# EAGLE design powerboard (EAGLE 9.4.2)
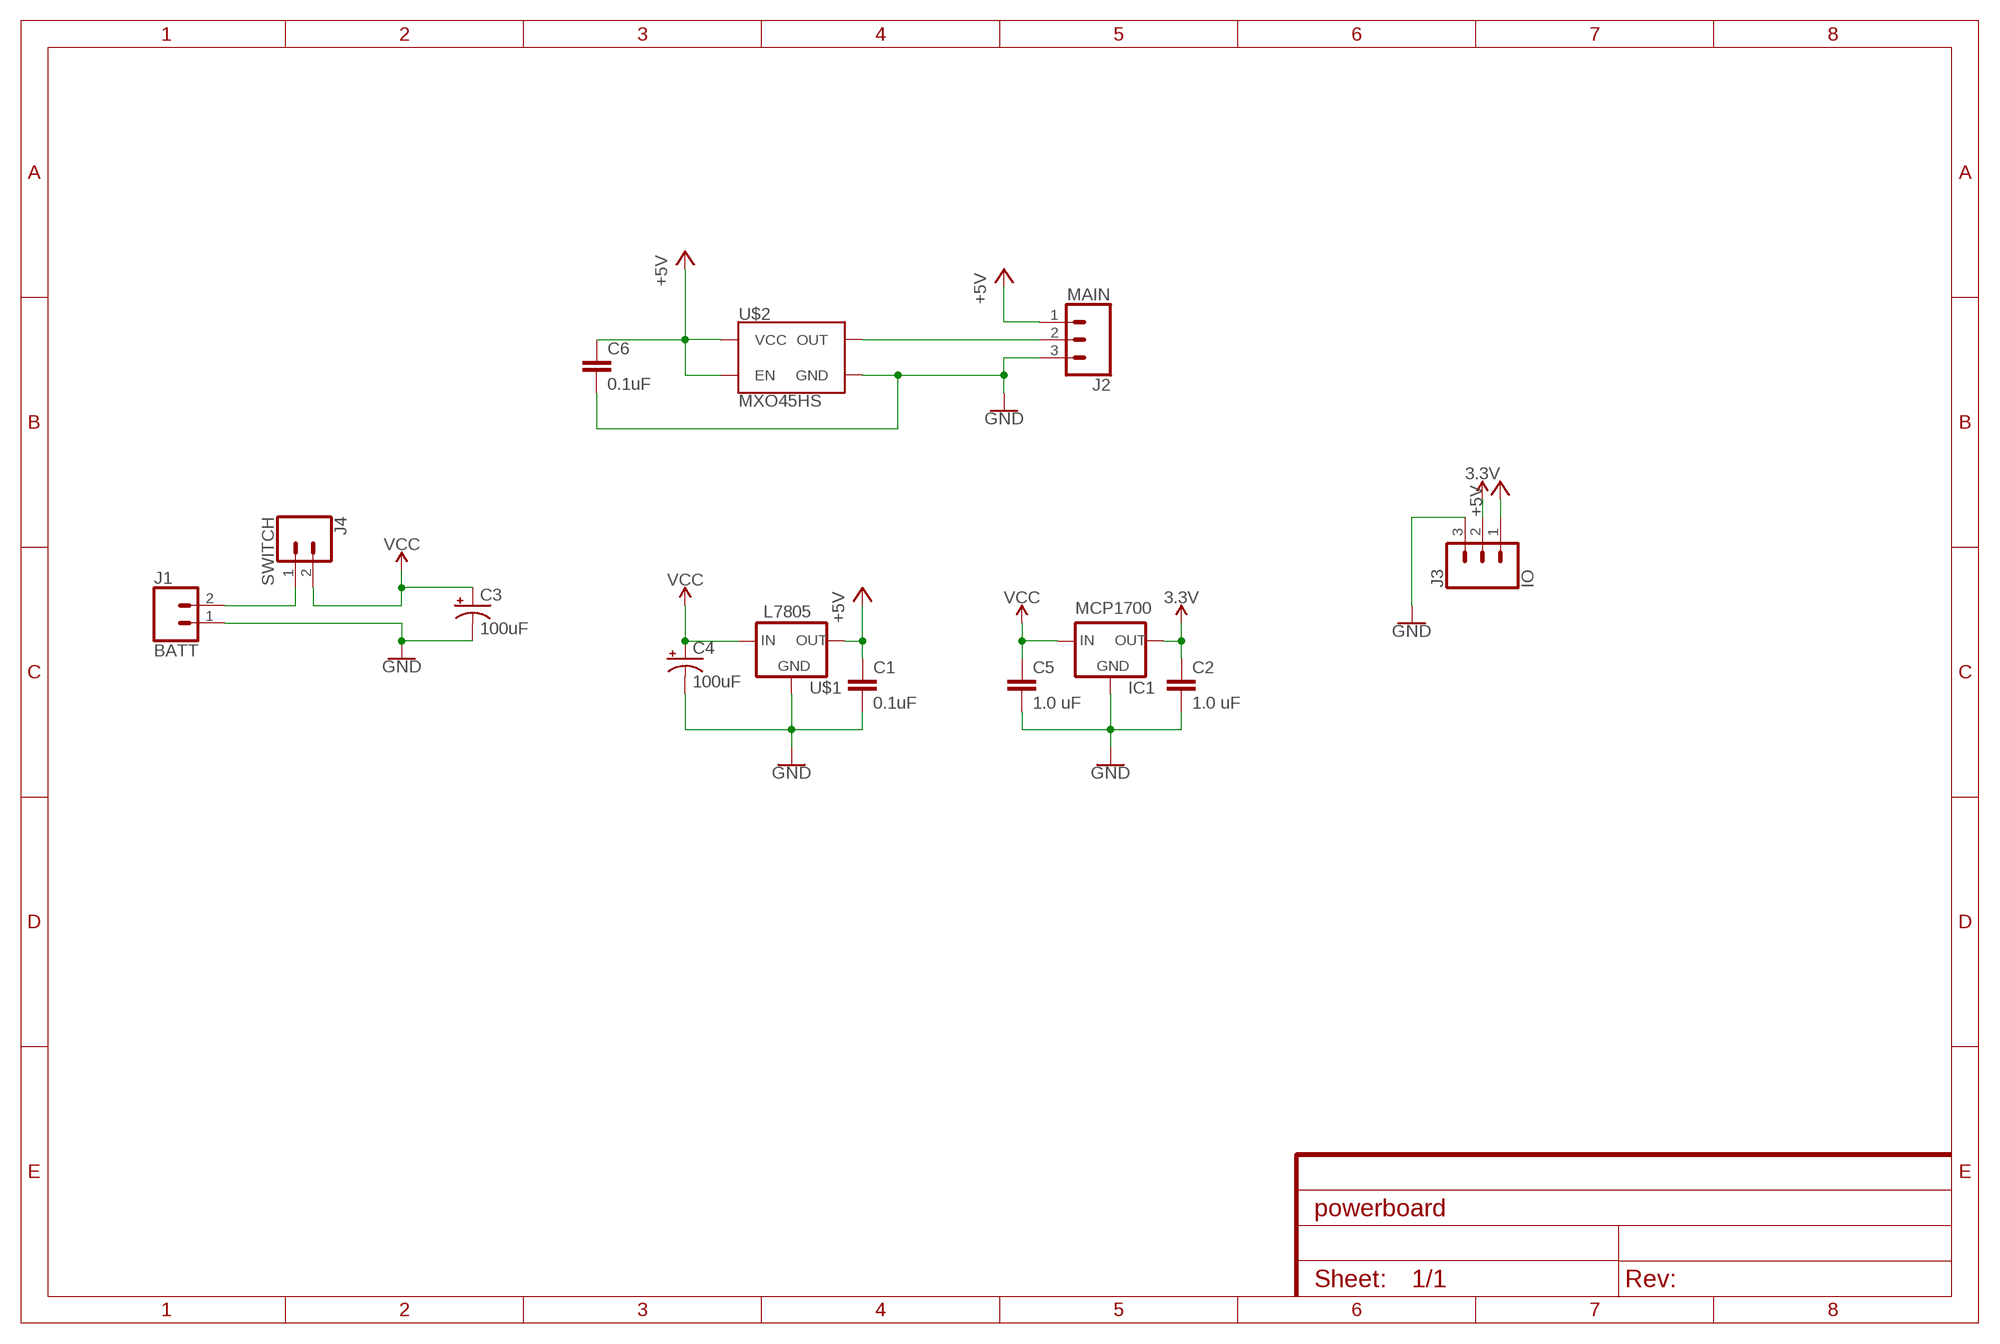
[diagram p0: schematic, sheet 1]

## Parts
C1  0.1uF  C2,5-3  [C2.5-3]
C2  1.0 uF  C2,5-3  [C2.5-3]
C3  100uF  100UF-POLAR-RADIAL-2.5MM-25V-20%  [CPOL-RADIAL-2.5MM-6.5MM]
C4  100uF  100UF-POLAR-RADIAL-2.5MM-25V-20%  [CPOL-RADIAL-2.5MM-6.5MM]
C5  1.0 uF  C2,5-3  [C2.5-3]
C6  0.1uF  C2,5-3  [C2.5-3]
IC1  MCP1700  [TO-92-AMMO]
J1  BATT  CONN_025MM  [SCREWTERMINAL-5MM-2]
J2  MAIN  CONN_03-SCREW-5MM  [SCREWTERMINAL-5MM-3]
J3  IO  CONN_03-SCREW-5MM  [SCREWTERMINAL-5MM-3]
J4  SWITCH  CONN_02  [1X02]
U$1  L7805  VREG_IGOTO-220  [TO-220-FLAT]
U$2  MXO45HS  [DIL08-HALF]

## Nets
3.3V: C2.1 IC1.3(OUT) J3.2
+5V: C1.1 C6.1 J2.1 J3.1 U$1.OUT U$2.1(EN) U$2.8(VCC)
GND: C1.2 C2.2 C3.2(-) C4.2(-) C5.2 C6.2 IC1.1(GND) J1.1 J2.3 J3.3 U$1.GND U$2.4(GND)
N$1: J1.2 J4.1
N$2: J2.2 U$2.5(OUT)
VCC: C3.1(+) C4.1(+) C5.1 IC1.2(IN) J4.2 U$1.IN

## Library data of the parts
C1 C2 C5 C6 = capacitor-wima:C: CAPACITOR naming: grid - package width
C3 C4 = SparkFun-Capacitors:100UF-POLAR: 100µF polarized capacitors A capacitor is a passive two-terminal electrical component used to store electrical energy temporarily in an electric field.; PROD_ID: CAP-08439
IC1 = wntrmute:MCP1700
J1 = SparkFun-Connectors:CONN_02: Multi connection point. Often used as Generic Header-pin footprint for 0.1 inch spaced/style header connections On any of the 0.1 inch spaced packages, you can populate with these: Break Away Headers - Straight <https://www.sparkfun.com/products/116> (PRT-00116) Break Away Male Headers - Right Angle <https://www.sparkfun.com/products/553> (PRT-00553) Female Headers <https://www.sparkfun.com/products/115> (PRT-00115) Break Away Headers - Machine Pin <https://www.sparkfun.com/products/117> (PRT-00117) Break Away Female Headers - Swiss Machine Pin <https://www.sparkfun.com/products/743> (PRT-00743) For SCREWTERMINALS and SPRING TERMINALS visit here: Screw Terimnals on SparkFun.com <https://www.sparkfun.com/search/results?term=Screw+Terminals> (5mm/3.5mm/2.54mm spacing) This device is also useful as a general connection point to wire up your design to another part of your project. Our various solder wires solder well into these plated through hole pads. Hook-Up Wire - Assortment (Stranded, 22 AWG) <https://www.sparkfun.com/products/11375> (PRT-11375) Hook-Up Wire - Assortment (Solid Core, 22 AWG) <https://www.sparkfun.com/products/11367> (PRT-11367) View the entire wire category on our website here <https://www.sparkfun.com/categories/141> Special notes: Molex polarized connector foot print use with: PRT-08233 with associated crimp pins and housings. 2.54_SCREWTERM for use with PRT-10571. 3.5mm Screw Terminal footprints for PRT-08084 5mm Screw Terminal footprints for use with PRT-08432; SF_SKU: PRT-08432
J2 J3 = SparkFun-Connectors:CONN_03: Multi connection point. Often used as Generic Header-pin footprint for 0.1 inch spaced/style header connections On any of the 0.1 inch spaced packages, you can populate with these: Break Away Headers - Straight <https://www.sparkfun.com/products/116> (PRT-00116) Break Away Male Headers - Right Angle <https://www.sparkfun.com/products/553> (PRT-00553) Female Headers <https://www.sparkfun.com/products/115> (PRT-00115) Break Away Headers - Machine Pin <https://www.sparkfun.com/products/117> (PRT-00117) Break Away Female Headers - Swiss Machine Pin <https://www.sparkfun.com/products/743> (PRT-00743) Stackable Header - 3 Pin (Female, 0.1") <https://www.sparkfun.com/products/13875> (PRT-13875) For SCREWTERMINALS and SPRING TERMINALS visit here: Screw Terimnals on SparkFun.com <https://www.sparkfun.com/search/results?term=Screw+Terminals> (5mm/3.5mm/2.54mm spacing) This device is also useful as a general connection point to wire up your design to another part of your project. Our various solder wires solder well into these plated through hole pads. Hook-Up Wire - Assortment (Stranded, 22 AWG) <https://www.sparkfun.com/products/11375> (PRT-11375) Hook-Up Wire - Assortment (Solid Core, 22 AWG) <https://www.sparkfun.com/products/11367> (PRT-11367) View the entire wire category on our website here <https://www.sparkfun.com/categories/141> Special notes: Molex polarized connector foot print use with SKU : PRT-08232 with associated crimp pins and housings.; PROD_ID: CONN-10134; SF_SKU: PRT-08433
J4 = SparkFun-Connectors:CONN_02: Multi connection point. Often used as Generic Header-pin footprint for 0.1 inch spaced/style header connections On any of the 0.1 inch spaced packages, you can populate with these: Break Away Headers - Straight <https://www.sparkfun.com/products/116> (PRT-00116) Break Away Male Headers - Right Angle <https://www.sparkfun.com/products/553> (PRT-00553) Female Headers <https://www.sparkfun.com/products/115> (PRT-00115) Break Away Headers - Machine Pin <https://www.sparkfun.com/products/117> (PRT-00117) Break Away Female Headers - Swiss Machine Pin <https://www.sparkfun.com/products/743> (PRT-00743) For SCREWTERMINALS and SPRING TERMINALS visit here: Screw Terimnals on SparkFun.com <https://www.sparkfun.com/search/results?term=Screw+Terminals> (5mm/3.5mm/2.54mm spacing) This device is also useful as a general connection point to wire up your design to another part of your project. Our various solder wires solder well into these plated through hole pads. Hook-Up Wire - Assortment (Stranded, 22 AWG) <https://www.sparkfun.com/products/11375> (PRT-11375) Hook-Up Wire - Assortment (Solid Core, 22 AWG) <https://www.sparkfun.com/products/11367> (PRT-11367) View the entire wire category on our website here <https://www.sparkfun.com/categories/141> Special notes: Molex polarized connector foot print use with: PRT-08233 with associated crimp pins and housings. 2.54_SCREWTERM for use with PRT-10571. 3.5mm Screw Terminal footprints for PRT-08084 5mm Screw Terminal footprints for use with PRT-08432
U$1 = wntrmute:VREG_IGO
U$2 = wntrmute:MXO45HS

## Net classes
0 default: width 0.254 mm, drill 0.508 mm, clearance 0.254 mm

## Board
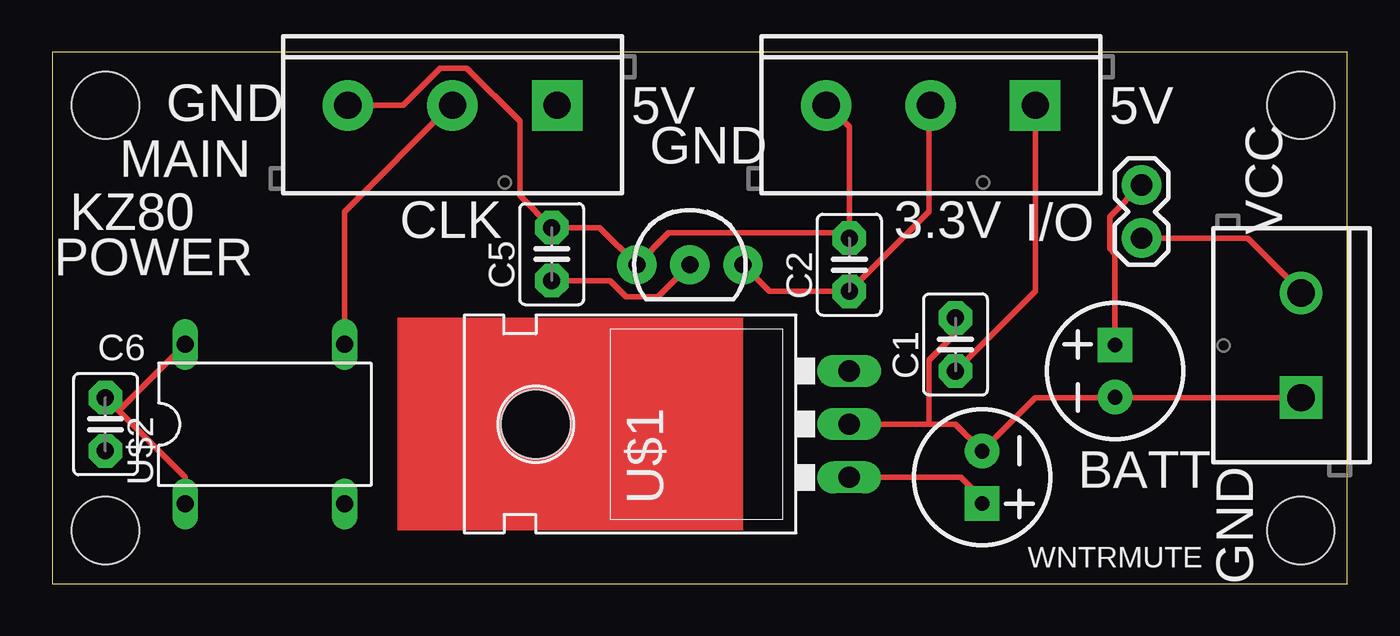
[diagram p1: board, top side]
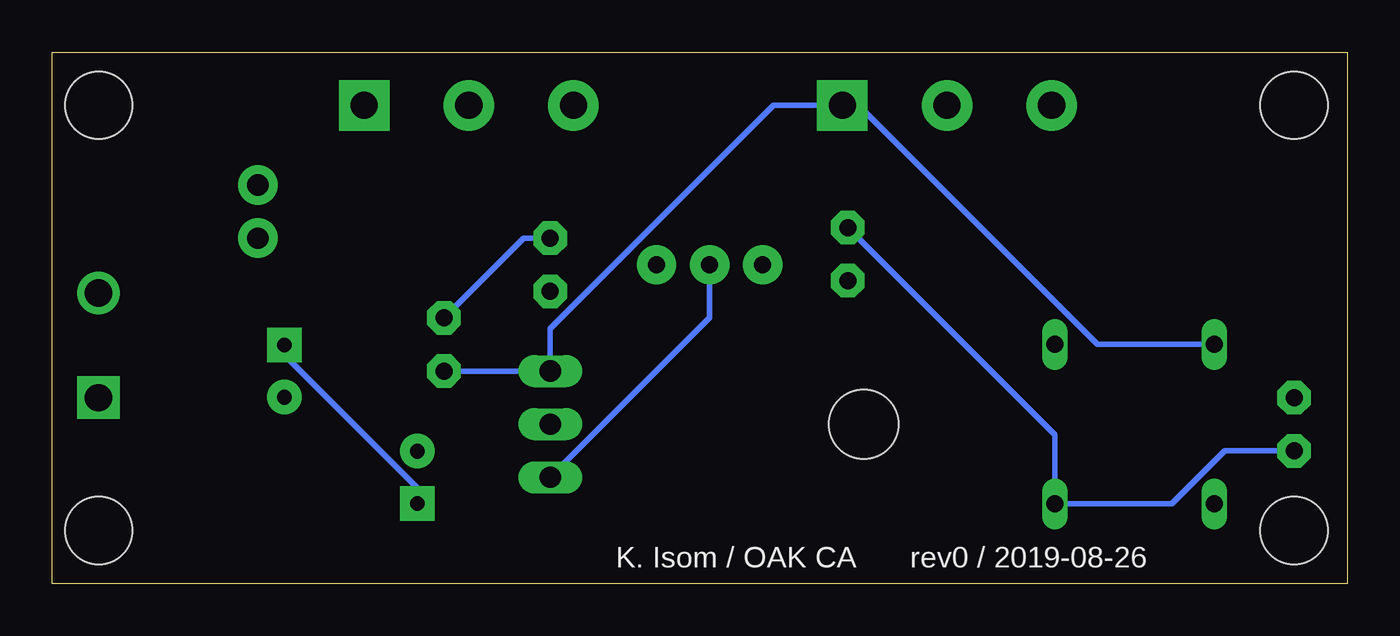
[diagram p2: board, bottom side, seen from below]

Size 61.9 x 25.39 mm. Coordinates in mm from the lower left corner, seen from the top.
Outline: 0,0 61.9,0 61.9,25.39 0,25.39 0,0
Copper layers (1*16): Top 0.035559375mm / dielectric 1.6mm / Bottom 0.035559375mm
Design rules "oshpark-2layer": minimum track width 6mil, minimum drill 10mil, track to track 6mil, track to pad 6mil, pad to pad 6mil, via to via 6mil, smd to smd 6mil, copper to edge 15mil, drill to drill 6mil, minimum pad ring 5mil, minimum via ring 5mil, stop-mask expansion 2.5mil, vias tented up to drill 0mil, thermal gap 10mil
Holes 3.2 mm at 59.69,22.86 2.54,22.86 2.54,2.54 59.69,2.54

### Footprints (pad centres in the part's own frame; a part is rotated, then mirrored left to right if it is on the bottom)
C2.5-3 = drill 0.813 pad 1.6 octagon: 1 -1.27,0; 2 1.27,0
CPOL-RADIAL-2.5MM-6.5MM = drill 0.7 pad 1.651 square: 1 1.25,0 | drill 0.7 pad 1.651: 2 -1.25,0
TO-92-AMMO = drill 0.813 pad 1.88: 1 -2.54,0; 2 0,0; 3 2.54,0
SCREWTERMINAL-5MM-2 = drill 1.3 pad 2.032 square: 1 0,0 | drill 1.3 pad 2.032: 2 5,0
SCREWTERMINAL-5MM-3 = drill 1.3 pad 2.413 square: 1 0,0 | drill 1.3 pad 2.413: 2 5,0; 3 10,0
1X02 = drill 1.016 pad 1.88: 1 0,0; 2 2.54,0
TO-220-FLAT = drill 1.016 long: GND 0,-3.81; IN -2.54,-3.81; OUT 2.54,-3.81 | hole 3.302: 0,11.176
DIL08-HALF = drill 0.813 long: 1 -3.81,-3.81; 4 3.81,-3.81; 5 3.81,3.81; 8 -3.81,3.81

### Placement (x,y rotation side)
C1  43.18,11.43 90 top
C2  38.1,15.24 90 top
C3  50.8,10.16 90 top
C4  44.45,5.08 270 top
C5  23.88,15.75 90 top
C6  2.54,7.62 270 top
IC1  30.48,15.24 0 top
J1  59.69,8.89 90 top
J2  24.13,22.86 180 top
J3  46.99,22.86 180 top
J4  52.07,16.51 90 top
U$1  34.29,7.62 90 top
U$2  10.16,7.62 0 top

### Tracks (layer width: path | path; a pad name or v marks a point on that pad's centre or on a via)
3.3V
  Top 0.254: IC1.3 34.29,13.97 C2.1 41.91,17.78 41.91,22.86 J3.2
+5V
  Top 0.254: U$2.1 6.35,5.08 3.05,8.38 | U$2.8 3.3,8.38 3.05,8.38 | 3.05,8.38 C6.1 | J3.1 46.99,13.97 C1.1
  Bottom 0.254: C1.1 U$1.OUT 38.1,12.19 27.43,22.86 J2.1 23.37,22.86 11.94,11.43 U$2.8
GND
  Top 0.254: 38.1,16.76 38.1,21.84 37.08,22.86 J3.3 | 41.91,7.62 43.18,7.62 44.45,6.35 | 41.91,7.62 U$1.GND | C1.2 43.18,11.94 41.91,10.67 41.91,7.62 | 50.8,8.89 46.99,8.89 44.45,6.35 | 44.45,6.35 C4.2 | 50.8,8.89 J1.1 | 50.8,8.89 C3.2 | J2.3 16.76,22.86 18.54,24.64 19.81,24.64 22.35,22.1 22.35,18.54 C5.2 26.16,17.02 IC1.1 29.46,16.76 38.1,16.76 | 38.1,16.76 C2.2
  Bottom 0.254: C2.2 39.37,16.51 C1.2 | C6.2 5.84,6.35 8.38,3.81 U$2.4 13.97,7.11 C5.2
N$1
  Top 0.254: J4.1 57.15,16.51 59.69,13.97 J1.2
N$2
  Top 0.254: U$2.5 13.97,17.78 19.05,22.86 J2.2
VCC
  Top 0.254: C5.1 26.67,14.48 27.43,13.72 28.96,13.72 IC1.2 | U$1.IN 43.43,5.08 44.45,4.06 C4.1 | C3.1 50.8,15.75 50.55,16 50.55,17.53 J4.2
  Bottom 0.254: C4.1 44.45,4.57 50.8,10.92 C3.1 | IC1.2 30.48,12.7 U$1.IN
(copper drawn outside any net)
  shapes: Top area x1

### Text on the board
tPlace: GND | 5V | 5V | GND | MAIN | VCC | KZ80 | CLK | 3.3V | I/O | POWER | BATT | GND | WNTRMUTE
bPlace: rev0 / 2019-08-26 | K. Isom / OAK CA